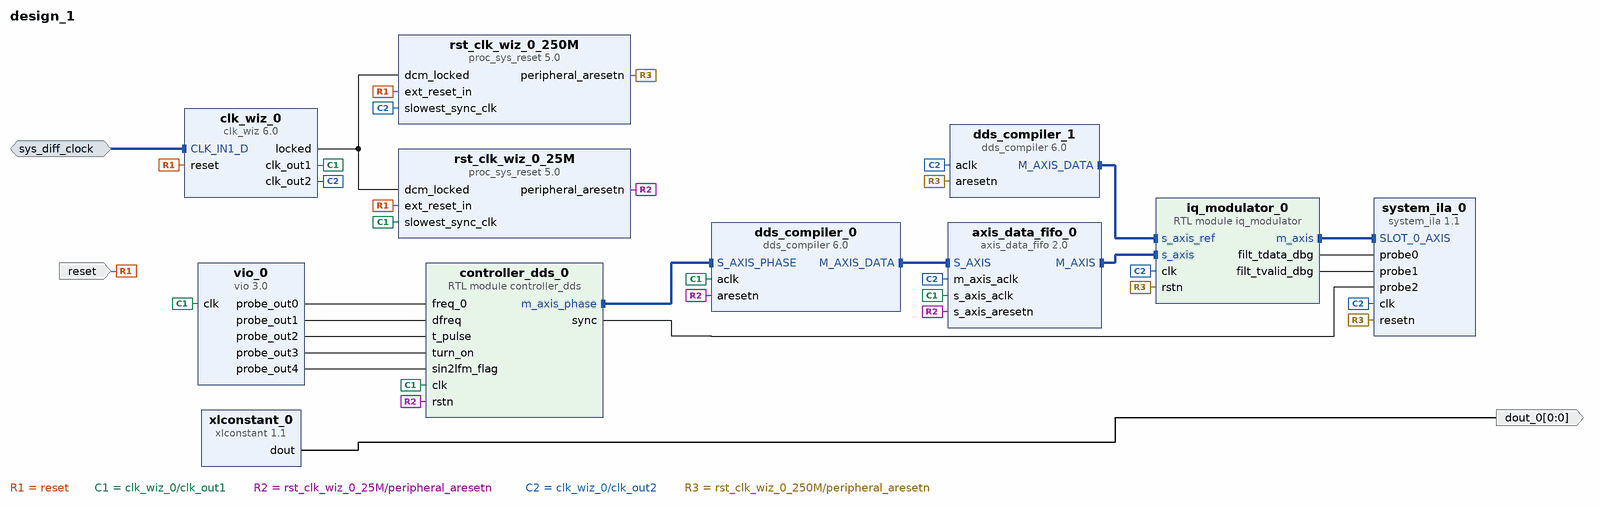
[diagram p0: block diagram of the top level]
# Vivado block design design_1, xc7z045ffg900-2, Vivado 2019.1.2
create_bd_design design_1

create_bd_intf_port -mode Slave -vlnv xilinx.com:interface:diff_clock_rtl:1.0 sys_diff_clock
set_property -dict {CONFIG.FREQ_HZ 200000000} [get_bd_intf_ports sys_diff_clock]
create_bd_port -dir I -type rst reset
set_property -dict {CONFIG.POLARITY ACTIVE_HIGH} [get_bd_ports reset]
create_bd_port -dir O -from 0 -to 0 dout_0

create_bd_cell -type ip -vlnv xilinx.com:ip:clk_wiz:6.0 clk_wiz_0
set_property -dict [list \
  CONFIG.CLKOUT1_JITTER 148.629 \
  CONFIG.CLKOUT1_PHASE_ERROR 89.971 \
  CONFIG.CLKOUT1_REQUESTED_OUT_FREQ 25.000 \
  CONFIG.CLKOUT2_JITTER 93.990 \
  CONFIG.CLKOUT2_PHASE_ERROR 89.971 \
  CONFIG.CLKOUT2_REQUESTED_OUT_FREQ 250.000 \
  CONFIG.CLKOUT2_USED true \
  CONFIG.CLK_IN1_BOARD_INTERFACE sys_diff_clock \
  CONFIG.MMCM_CLKFBOUT_MULT_F 5.000 \
  CONFIG.MMCM_CLKOUT0_DIVIDE_F 40.000 \
  CONFIG.MMCM_CLKOUT1_DIVIDE 4 \
  CONFIG.NUM_OUT_CLKS 2 \
  CONFIG.RESET_BOARD_INTERFACE reset \
  CONFIG.USE_BOARD_FLOW true \
] [get_bd_cells clk_wiz_0]
create_bd_cell -type ip -vlnv xilinx.com:ip:dds_compiler:6.0 dds_compiler_0
set_property -dict [list \
  CONFIG.DATA_Has_TLAST Not_Required \
  CONFIG.DDS_Clock_Rate 25 \
  CONFIG.Frequency_Resolution 0.4 \
  CONFIG.Has_ARESETn true \
  CONFIG.Has_Phase_Out false \
  CONFIG.M_DATA_Has_TUSER Not_Required \
  CONFIG.Noise_Shaping None \
  CONFIG.Output_Frequency1 0 \
  CONFIG.Output_Selection Sine_and_Cosine \
  CONFIG.Output_Width 8 \
  CONFIG.PINC1 0 \
  CONFIG.Parameter_Entry Hardware_Parameters \
  CONFIG.Phase_Increment Streaming \
  CONFIG.Phase_Width 16 \
  CONFIG.S_PHASE_Has_TUSER Not_Required \
] [get_bd_cells dds_compiler_0]
create_bd_cell -type module -reference controller_dds controller_dds_0
create_bd_cell -type ip -vlnv xilinx.com:ip:proc_sys_reset:5.0 rst_clk_wiz_0_25M
create_bd_cell -type ip -vlnv xilinx.com:ip:vio:3.0 vio_0
set_property -dict [list \
  CONFIG.C_NUM_PROBE_IN 0 \
  CONFIG.C_NUM_PROBE_OUT 5 \
  CONFIG.C_PROBE_OUT0_WIDTH 32 \
  CONFIG.C_PROBE_OUT1_INIT_VAL 0x000003e8 \
  CONFIG.C_PROBE_OUT1_WIDTH 32 \
  CONFIG.C_PROBE_OUT2_INIT_VAL 0x00000FA0 \
  CONFIG.C_PROBE_OUT2_WIDTH 32 \
  CONFIG.C_PROBE_OUT3_INIT_VAL 0x1 \
  CONFIG.C_PROBE_OUT4_INIT_VAL 0x1 \
] [get_bd_cells vio_0]
create_bd_cell -type module -reference iq_modulator iq_modulator_0
set_property -dict [list \
  CONFIG.MEM_FILE D:/work/radar_course/lesson_6/vivado/iq_mod_zc706/iq_mod_zc706.srcs/sources_1/imports/hdl/coef_lp.mem \
] [get_bd_cells iq_modulator_0]
create_bd_cell -type ip -vlnv xilinx.com:ip:dds_compiler:6.0 dds_compiler_1
set_property -dict [list \
  CONFIG.DDS_Clock_Rate 250 \
  CONFIG.Frequency_Resolution 0.4 \
  CONFIG.Has_ARESETn true \
  CONFIG.Has_Phase_Out false \
  CONFIG.M_DATA_Has_TUSER Not_Required \
  CONFIG.Noise_Shaping None \
  CONFIG.Output_Frequency1 0 \
  CONFIG.Output_Width 8 \
  CONFIG.PINC1 0010000011000100 \
  CONFIG.Parameter_Entry Hardware_Parameters \
  CONFIG.Phase_Width 16 \
] [get_bd_cells dds_compiler_1]
create_bd_cell -type ip -vlnv xilinx.com:ip:axis_data_fifo:2.0 axis_data_fifo_0
set_property -dict {CONFIG.IS_ACLK_ASYNC 1} [get_bd_cells axis_data_fifo_0]
create_bd_cell -type ip -vlnv xilinx.com:ip:proc_sys_reset:5.0 rst_clk_wiz_0_250M
create_bd_cell -type ip -vlnv xilinx.com:ip:system_ila:1.1 system_ila_0
set_property -dict [list \
  CONFIG.C_DATA_DEPTH 4096 \
  CONFIG.C_MON_TYPE MIX \
  CONFIG.C_NUM_OF_PROBES 3 \
  CONFIG.C_SLOT_0_INTF_TYPE xilinx.com:interface:axis_rtl:1.0 \
] [get_bd_cells system_ila_0]
create_bd_cell -type ip -vlnv xilinx.com:ip:xlconstant:1.1 xlconstant_0

# ---- connections ----

connect_bd_intf_net [get_bd_intf_ports sys_diff_clock] [get_bd_intf_pins clk_wiz_0/CLK_IN1_D]
connect_bd_intf_net [get_bd_intf_pins controller_dds_0/m_axis_phase] [get_bd_intf_pins dds_compiler_0/S_AXIS_PHASE]
connect_bd_intf_net [get_bd_intf_pins axis_data_fifo_0/S_AXIS] [get_bd_intf_pins dds_compiler_0/M_AXIS_DATA]
connect_bd_intf_net [get_bd_intf_pins dds_compiler_1/M_AXIS_DATA] [get_bd_intf_pins iq_modulator_0/s_axis_ref]
connect_bd_intf_net [get_bd_intf_pins iq_modulator_0/m_axis] [get_bd_intf_pins system_ila_0/SLOT_0_AXIS]
connect_bd_intf_net [get_bd_intf_pins axis_data_fifo_0/M_AXIS] [get_bd_intf_pins iq_modulator_0/s_axis]
connect_bd_net [get_bd_ports reset] \
  [get_bd_pins clk_wiz_0/reset] [get_bd_pins rst_clk_wiz_0_25M/ext_reset_in] [get_bd_pins rst_clk_wiz_0_250M/ext_reset_in]
connect_bd_net [get_bd_pins clk_wiz_0/clk_out1] \
  [get_bd_pins controller_dds_0/clk] [get_bd_pins dds_compiler_0/aclk] [get_bd_pins rst_clk_wiz_0_25M/slowest_sync_clk] \
  [get_bd_pins vio_0/clk] [get_bd_pins axis_data_fifo_0/s_axis_aclk]
connect_bd_net [get_bd_pins clk_wiz_0/locked] [get_bd_pins rst_clk_wiz_0_25M/dcm_locked] [get_bd_pins rst_clk_wiz_0_250M/dcm_locked]
connect_bd_net [get_bd_pins rst_clk_wiz_0_25M/peripheral_aresetn] \
  [get_bd_pins controller_dds_0/rstn] [get_bd_pins dds_compiler_0/aresetn] [get_bd_pins axis_data_fifo_0/s_axis_aresetn]
connect_bd_net [get_bd_pins vio_0/probe_out0] [get_bd_pins controller_dds_0/freq_0]
connect_bd_net [get_bd_pins vio_0/probe_out1] [get_bd_pins controller_dds_0/dfreq]
connect_bd_net [get_bd_pins vio_0/probe_out2] [get_bd_pins controller_dds_0/t_pulse]
connect_bd_net [get_bd_pins vio_0/probe_out3] [get_bd_pins controller_dds_0/turn_on]
connect_bd_net [get_bd_pins vio_0/probe_out4] [get_bd_pins controller_dds_0/sin2lfm_flag]
connect_bd_net [get_bd_pins clk_wiz_0/clk_out2] \
  [get_bd_pins axis_data_fifo_0/m_axis_aclk] [get_bd_pins dds_compiler_1/aclk] [get_bd_pins iq_modulator_0/clk] \
  [get_bd_pins rst_clk_wiz_0_250M/slowest_sync_clk] [get_bd_pins system_ila_0/clk]
connect_bd_net [get_bd_pins rst_clk_wiz_0_250M/peripheral_aresetn] \
  [get_bd_pins dds_compiler_1/aresetn] [get_bd_pins iq_modulator_0/rstn] [get_bd_pins system_ila_0/resetn]
connect_bd_net [get_bd_pins iq_modulator_0/filt_tdata_dbg] [get_bd_pins system_ila_0/probe0]
connect_bd_net [get_bd_pins iq_modulator_0/filt_tvalid_dbg] [get_bd_pins system_ila_0/probe1]
connect_bd_net [get_bd_pins controller_dds_0/sync] [get_bd_pins system_ila_0/probe2]
connect_bd_net [get_bd_pins xlconstant_0/dout] [get_bd_ports dout_0]

validate_bd_design
save_bd_design
